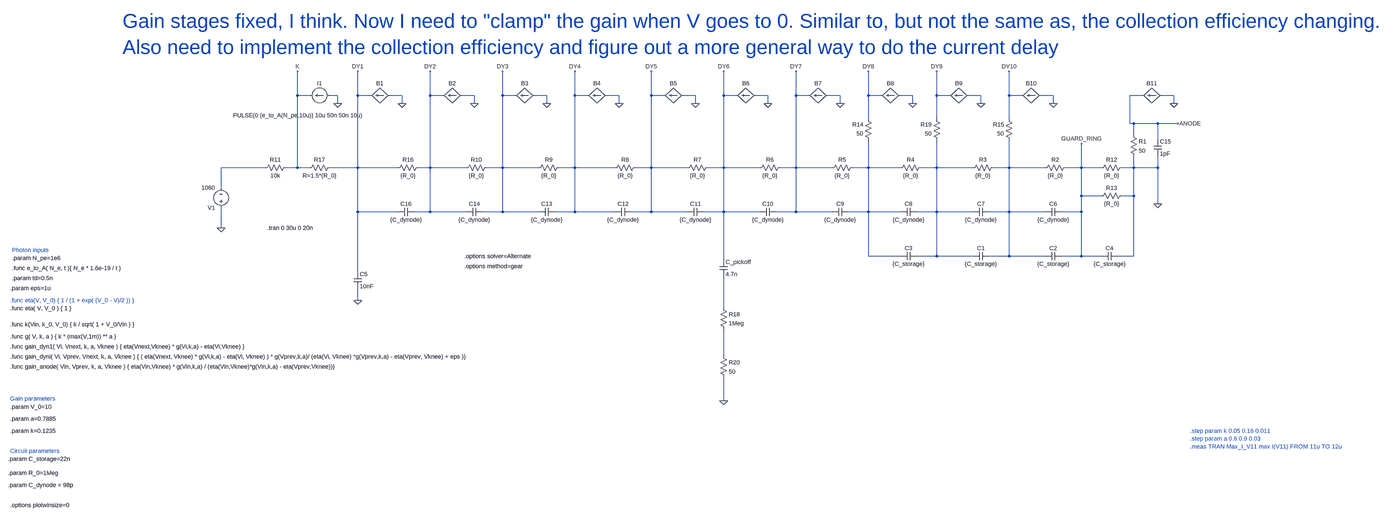
[diagram p0: schematic R12699 model - power law - S2 - no Vsources.asc, whole sheet]
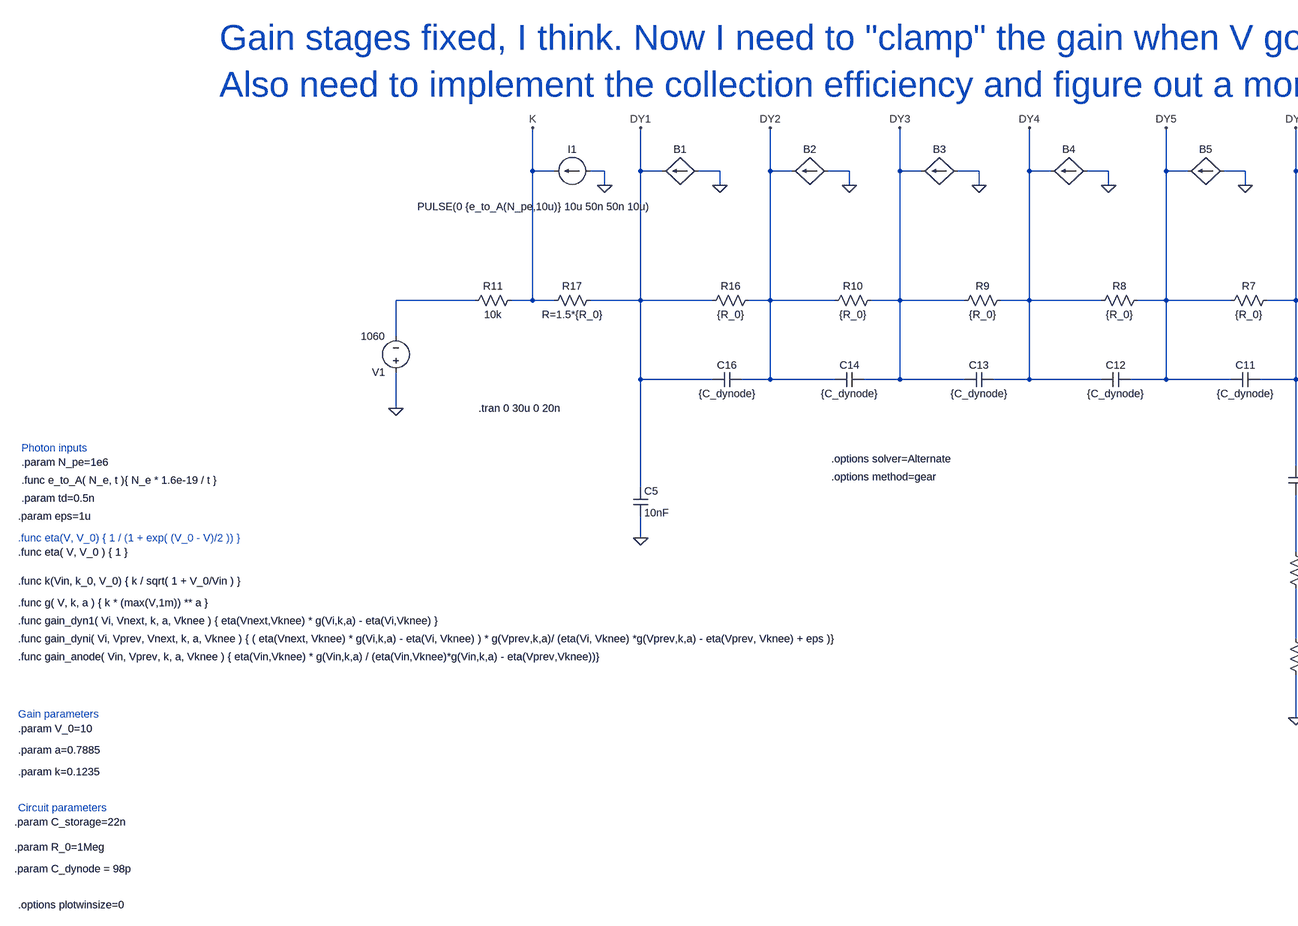
[diagram p1: schematic R12699 model - power law - S2 - no Vsources.asc, part, row 1 of 1, column 1 of 2]
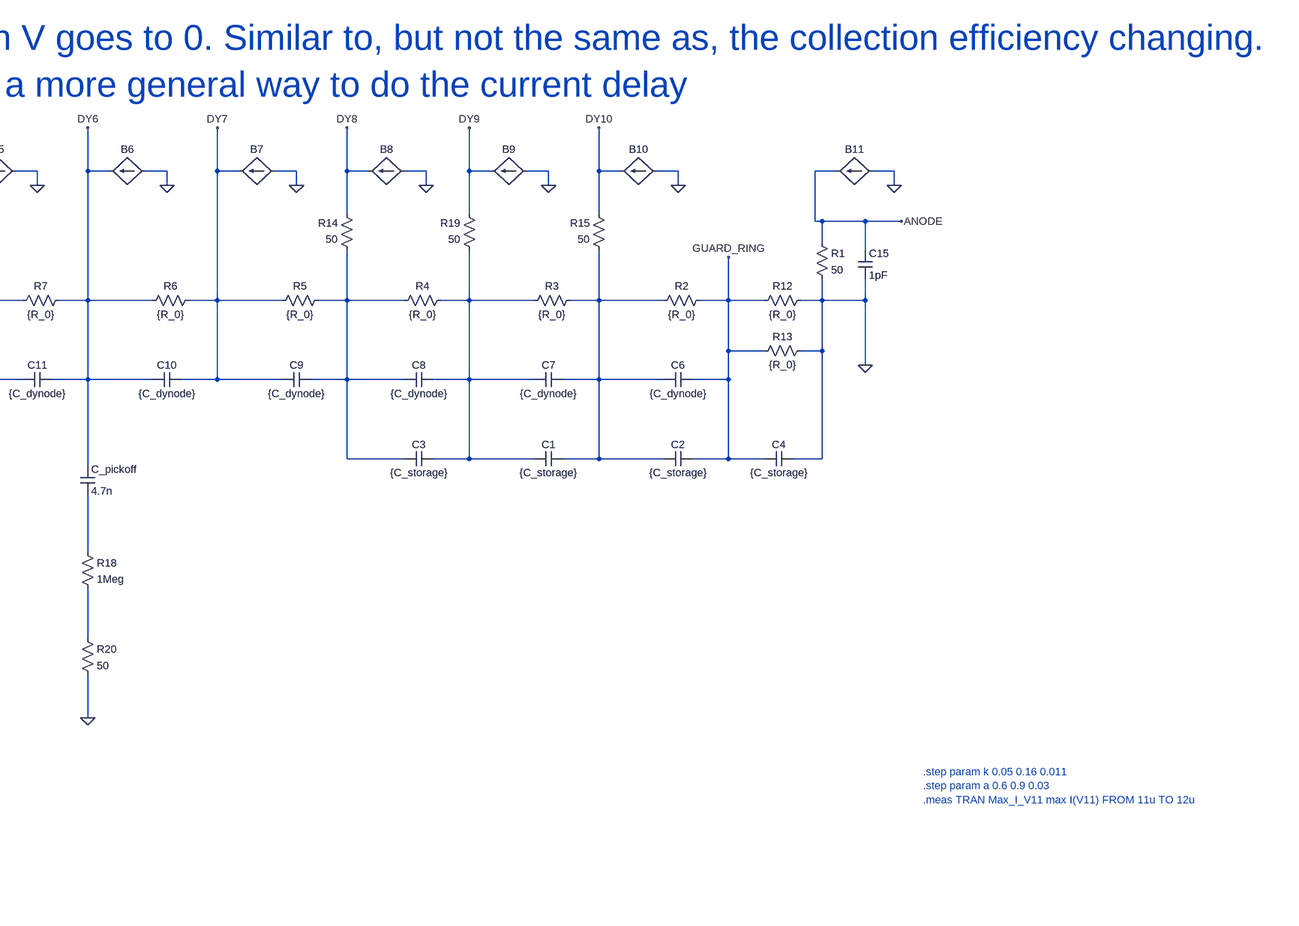
[diagram p2: schematic R12699 model - power law - S2 - no Vsources.asc, part, row 1 of 1, column 2 of 2]
R12699 model - power law - S2 - no Vsources.asc, the LTspice schematic file:
Version 4.1
SHEET 1 3076 1700
WIRE -2464 -544 -2464 -640
WIRE -2416 -544 -2464 -544
WIRE -2304 -544 -2336 -544
WIRE -2224 -544 -2224 -640
WIRE -2176 -544 -2224 -544
WIRE -2048 -544 -2096 -544
WIRE -1936 -544 -1936 -640
WIRE -1888 -544 -1936 -544
WIRE -1760 -544 -1808 -544
WIRE -1648 -544 -1648 -640
WIRE -1600 -544 -1648 -544
WIRE -1472 -544 -1520 -544
WIRE -1360 -544 -1360 -640
WIRE -1312 -544 -1360 -544
WIRE -1184 -544 -1232 -544
WIRE -1056 -544 -1056 -640
WIRE -1008 -544 -1056 -544
WIRE -880 -544 -928 -544
WIRE -768 -544 -768 -640
WIRE -720 -544 -768 -544
WIRE -592 -544 -640 -544
WIRE -480 -544 -480 -640
WIRE -432 -544 -480 -544
WIRE -304 -544 -352 -544
WIRE -192 -544 -192 -640
WIRE -144 -544 -192 -544
WIRE -16 -544 -64 -544
WIRE 80 -544 80 -640
WIRE 128 -544 80 -544
WIRE 256 -544 208 -544
WIRE 368 -544 368 -640
WIRE 416 -544 368 -544
WIRE 544 -544 496 -544
WIRE 896 -544 848 -544
WIRE 1024 -544 976 -544
WIRE -2304 -512 -2304 -544
WIRE -2048 -512 -2048 -544
WIRE -1760 -512 -1760 -544
WIRE -1472 -512 -1472 -544
WIRE -1184 -512 -1184 -544
WIRE -880 -512 -880 -544
WIRE -592 -512 -592 -544
WIRE -304 -512 -304 -544
WIRE -16 -512 -16 -544
WIRE 256 -512 256 -544
WIRE 544 -512 544 -544
WIRE 1024 -512 1024 -544
WIRE -192 -448 -192 -544
WIRE 80 -448 80 -544
WIRE 368 -448 368 -544
WIRE 848 -432 848 -544
WIRE 864 -432 848 -432
WIRE 960 -432 864 -432
WIRE 1040 -432 960 -432
WIRE 864 -384 864 -432
WIRE 960 -368 960 -432
WIRE -2592 -256 -2768 -256
WIRE -2464 -256 -2464 -544
WIRE -2464 -256 -2512 -256
WIRE -2416 -256 -2464 -256
WIRE -2224 -256 -2224 -544
WIRE -2224 -256 -2336 -256
WIRE -2064 -256 -2224 -256
WIRE -1936 -256 -1936 -544
WIRE -1936 -256 -1984 -256
WIRE -1792 -256 -1936 -256
WIRE -1648 -256 -1648 -544
WIRE -1648 -256 -1712 -256
WIRE -1504 -256 -1648 -256
WIRE -1360 -256 -1360 -544
WIRE -1360 -256 -1424 -256
WIRE -1200 -256 -1360 -256
WIRE -1056 -256 -1056 -544
WIRE -1056 -256 -1120 -256
WIRE -912 -256 -1056 -256
WIRE -768 -256 -768 -544
WIRE -768 -256 -832 -256
WIRE -624 -256 -768 -256
WIRE -480 -256 -480 -544
WIRE -480 -256 -544 -256
WIRE -336 -256 -480 -256
WIRE -192 -256 -192 -368
WIRE -192 -256 -256 -256
WIRE -64 -256 -192 -256
WIRE 80 -256 80 -368
WIRE 80 -256 16 -256
WIRE 224 -256 80 -256
WIRE 368 -256 368 -368
WIRE 368 -256 304 -256
WIRE 512 -256 368 -256
WIRE 656 -256 656 -352
WIRE 656 -256 592 -256
WIRE 736 -256 656 -256
WIRE 864 -256 864 -304
WIRE 864 -256 816 -256
WIRE 960 -256 960 -304
WIRE 960 -256 864 -256
WIRE -2768 -176 -2768 -256
WIRE 656 -144 656 -256
WIRE 736 -144 656 -144
WIRE 864 -144 864 -256
WIRE 864 -144 816 -144
WIRE 960 -112 960 -256
WIRE -2224 -80 -2224 -256
WIRE -2064 -80 -2224 -80
WIRE -1936 -80 -1936 -256
WIRE -1936 -80 -2000 -80
WIRE -1792 -80 -1936 -80
WIRE -1648 -80 -1648 -256
WIRE -1648 -80 -1728 -80
WIRE -1504 -80 -1648 -80
WIRE -1360 -80 -1360 -256
WIRE -1360 -80 -1440 -80
WIRE -1200 -80 -1360 -80
WIRE -1056 -80 -1056 -256
WIRE -1056 -80 -1136 -80
WIRE -912 -80 -1056 -80
WIRE -768 -80 -768 -256
WIRE -768 -80 -848 -80
WIRE -624 -80 -768 -80
WIRE -480 -80 -480 -256
WIRE -480 -80 -560 -80
WIRE -336 -80 -480 -80
WIRE -192 -80 -192 -256
WIRE -192 -80 -272 -80
WIRE -64 -80 -192 -80
WIRE 80 -80 80 -256
WIRE 80 -80 0 -80
WIRE 224 -80 80 -80
WIRE 368 -80 368 -256
WIRE 368 -80 288 -80
WIRE 512 -80 368 -80
WIRE 656 -80 656 -144
WIRE 656 -80 576 -80
WIRE -2768 -16 -2768 -96
WIRE -192 96 -192 -80
WIRE -64 96 -192 96
WIRE 80 96 80 -80
WIRE 80 96 0 96
WIRE 224 96 80 96
WIRE 368 96 368 -80
WIRE 368 96 288 96
WIRE 512 96 368 96
WIRE 656 96 656 -80
WIRE 656 96 576 96
WIRE 736 96 656 96
WIRE 864 96 864 -144
WIRE 864 96 800 96
WIRE -768 112 -768 -80
WIRE -2224 160 -2224 -80
WIRE -2224 272 -2224 224
WIRE -768 304 -768 176
WIRE -768 496 -768 384
WIRE -768 672 -768 576
FLAG -2224 272 0
FLAG 960 -112 0
FLAG -2768 -16 0
FLAG -2224 -640 DY1
FLAG -1936 -640 DY2
FLAG -1648 -640 DY3
FLAG -1360 -640 DY4
FLAG -1056 -640 DY5
FLAG -768 -640 DY6
FLAG -480 -640 DY7
FLAG -192 -640 DY8
FLAG 80 -640 DY9
FLAG 368 -640 DY10
FLAG 656 -352 GUARD_RING
FLAG -2464 -640 K
FLAG 1040 -432 ANODE
FLAG -768 672 0
FLAG -2304 -512 0
FLAG -2048 -512 0
FLAG -1760 -512 0
FLAG -1472 -512 0
FLAG -1184 -512 0
FLAG -880 -512 0
FLAG -592 -512 0
FLAG -304 -512 0
FLAG -16 -512 0
FLAG 256 -512 0
FLAG 544 -512 0
FLAG 1024 -512 0
SYMBOL cap 288 80 R90
WINDOW 0 0 32 VBottom 2
WINDOW 3 32 32 VTop 2
SYMATTR InstName C1
SYMATTR Value {C_storage}
SYMBOL cap 576 80 R90
WINDOW 0 0 32 VBottom 2
WINDOW 3 32 32 VTop 2
SYMATTR InstName C2
SYMATTR Value {C_storage}
SYMBOL cap 0 80 R90
WINDOW 0 0 32 VBottom 2
WINDOW 3 32 32 VTop 2
SYMATTR InstName C3
SYMATTR Value {C_storage}
SYMBOL cap 800 80 R90
WINDOW 0 0 32 VBottom 2
WINDOW 3 32 32 VTop 2
SYMATTR InstName C4
SYMATTR Value {C_storage}
SYMBOL cap -2240 160 R0
SYMATTR InstName C5
SYMATTR Value 10nF
SYMBOL cap 576 -96 R90
WINDOW 0 0 32 VBottom 2
WINDOW 3 32 32 VTop 2
SYMATTR InstName C6
SYMATTR Value {C_dynode}
SYMBOL res 608 -272 R90
WINDOW 0 0 56 VBottom 2
WINDOW 3 32 56 VTop 2
SYMATTR InstName R2
SYMATTR Value {R_0}
SYMBOL cap 288 -96 R90
WINDOW 0 0 32 VBottom 2
WINDOW 3 32 32 VTop 2
SYMATTR InstName C7
SYMATTR Value {C_dynode}
SYMBOL res 320 -272 R90
WINDOW 0 0 56 VBottom 2
WINDOW 3 32 56 VTop 2
SYMATTR InstName R3
SYMATTR Value {R_0}
SYMBOL cap 0 -96 R90
WINDOW 0 0 32 VBottom 2
WINDOW 3 32 32 VTop 2
SYMATTR InstName C8
SYMATTR Value {C_dynode}
SYMBOL res 32 -272 R90
WINDOW 0 0 56 VBottom 2
WINDOW 3 32 56 VTop 2
SYMATTR InstName R4
SYMATTR Value {R_0}
SYMBOL cap -272 -96 R90
WINDOW 0 0 32 VBottom 2
WINDOW 3 32 32 VTop 2
SYMATTR InstName C9
SYMATTR Value {C_dynode}
SYMBOL res -240 -272 R90
WINDOW 0 0 56 VBottom 2
WINDOW 3 32 56 VTop 2
SYMATTR InstName R5
SYMATTR Value {R_0}
SYMBOL cap -560 -96 R90
WINDOW 0 0 32 VBottom 2
WINDOW 3 32 32 VTop 2
SYMATTR InstName C10
SYMATTR Value {C_dynode}
SYMBOL res -528 -272 R90
WINDOW 0 0 56 VBottom 2
WINDOW 3 32 56 VTop 2
SYMATTR InstName R6
SYMATTR Value {R_0}
SYMBOL cap -848 -96 R90
WINDOW 0 0 32 VBottom 2
WINDOW 3 32 32 VTop 2
SYMATTR InstName C11
SYMATTR Value {C_dynode}
SYMBOL res -816 -272 R90
WINDOW 0 0 56 VBottom 2
WINDOW 3 32 56 VTop 2
SYMATTR InstName R7
SYMATTR Value {R_0}
SYMBOL cap -1136 -96 R90
WINDOW 0 0 32 VBottom 2
WINDOW 3 32 32 VTop 2
SYMATTR InstName C12
SYMATTR Value {C_dynode}
SYMBOL res -1104 -272 R90
WINDOW 0 0 56 VBottom 2
WINDOW 3 32 56 VTop 2
SYMATTR InstName R8
SYMATTR Value {R_0}
SYMBOL cap -1440 -96 R90
WINDOW 0 0 32 VBottom 2
WINDOW 3 32 32 VTop 2
SYMATTR InstName C13
SYMATTR Value {C_dynode}
SYMBOL res -1408 -272 R90
WINDOW 0 0 56 VBottom 2
WINDOW 3 32 56 VTop 2
SYMATTR InstName R9
SYMATTR Value {R_0}
SYMBOL cap -1728 -96 R90
WINDOW 0 0 32 VBottom 2
WINDOW 3 32 32 VTop 2
SYMATTR InstName C14
SYMATTR Value {C_dynode}
SYMBOL res -1696 -272 R90
WINDOW 0 0 56 VBottom 2
WINDOW 3 32 56 VTop 2
SYMATTR InstName R10
SYMATTR Value {R_0}
SYMBOL res -2496 -272 R90
WINDOW 0 0 56 VBottom 2
WINDOW 3 32 56 VTop 2
SYMATTR InstName R11
SYMATTR Value 10k
SYMBOL res 832 -272 R90
WINDOW 0 0 56 VBottom 2
WINDOW 3 32 56 VTop 2
SYMATTR InstName R12
SYMATTR Value {R_0}
SYMBOL res 832 -160 R90
WINDOW 0 0 56 VBottom 2
WINDOW 3 32 56 VTop 2
SYMATTR InstName R13
SYMATTR Value {R_0}
SYMBOL res 384 -352 R180
WINDOW 0 36 76 Left 2
WINDOW 3 36 40 Left 2
SYMATTR InstName R15
SYMATTR Value 50
SYMBOL cap -2000 -96 R90
WINDOW 0 0 32 VBottom 2
WINDOW 3 32 32 VTop 2
SYMATTR InstName C16
SYMATTR Value {C_dynode}
SYMBOL res -1968 -272 R90
WINDOW 0 0 56 VBottom 2
WINDOW 3 32 56 VTop 2
SYMATTR InstName R16
SYMATTR Value {R_0}
SYMBOL bi -2096 -544 R90
WINDOW 0 -32 40 VBottom 2
WINDOW 3 32 40 Invisible 2
SYMATTR InstName B1
SYMATTR Value I  = I(I1) * gain_dyn1( V(DY1,K), V( DY2, DY1), k, a, V_0 )
SYMBOL bi -1808 -544 R90
WINDOW 0 -32 40 VBottom 2
WINDOW 3 32 40 Invisible 2
SYMATTR InstName B2
SYMATTR Value I=delay(I(B1),td) * gain_dyni( V( DY2, DY1), V(DY1,K),  V( DY3, DY2), k, a, V_0 )
SYMBOL bi -1520 -544 R90
WINDOW 0 -32 40 VBottom 2
WINDOW 3 32 40 Invisible 2
SYMATTR InstName B3
SYMATTR Value I=delay(I(B2),td)* gain_dyni( V( DY3, DY2), V(DY2, DY1), V( DY4, DY3), k, a, V_0 )
SYMBOL current -2336 -544 R90
WINDOW 0 -32 40 VBottom 2
WINDOW 3 64 125 VTop 2
WINDOW 123 0 0 Left 0
WINDOW 39 0 0 Left 0
SYMATTR InstName I1
SYMATTR Value PULSE(0 {e_to_A(N_pe,10u)} 10u 50n 50n 10u)
SYMBOL bi -1232 -544 R90
WINDOW 0 -32 40 VBottom 2
WINDOW 3 32 40 Invisible 2
SYMATTR InstName B4
SYMATTR Value I=delay(I(B3),td)* gain_dyni( V( DY4, DY3), V(DY3,DY2), V( DY5, DY4), k, a, V_0 )
SYMBOL bi -928 -544 R90
WINDOW 0 -32 40 VBottom 2
WINDOW 3 32 40 Invisible 2
SYMATTR InstName B5
SYMATTR Value I=delay(I(B4),td) * gain_dyni( V( DY5, DY4), V(DY4,DY3), V( DY6, DY5), k, a, V_0 )
SYMBOL bi -640 -544 R90
WINDOW 0 -32 40 VBottom 2
WINDOW 3 32 40 Invisible 2
SYMATTR InstName B6
SYMATTR Value I=delay(I(B5),td) * gain_dyni( V( DY6, DY5), V(DY5,DY4), V( DY7, DY6), k, a, V_0 )
SYMBOL bi -352 -544 R90
WINDOW 0 -32 40 VBottom 2
WINDOW 3 32 40 Invisible 2
SYMATTR InstName B7
SYMATTR Value I=delay(I(B6),td) * gain_dyni( V( DY7, DY6), V(DY6,DY5), V( DY8, DY7), k, a, V_0 )
SYMBOL bi -64 -544 R90
WINDOW 0 -32 40 VBottom 2
WINDOW 3 32 40 Invisible 2
SYMATTR InstName B8
SYMATTR Value I=delay(I(B7),td)* gain_dyni( V( DY8, DY7), V(DY7,DY6), V( DY9, DY8), k, a, V_0 )
SYMBOL bi 208 -544 R90
WINDOW 0 -32 40 VBottom 2
WINDOW 3 32 40 Invisible 2
SYMATTR InstName B9
SYMATTR Value I=delay(I(B8),td) * gain_dyni( V( DY9, DY8), V(DY8,DY7), V(DY10,DY9), k, a, V_0 )
SYMBOL bi 496 -544 R90
WINDOW 0 -32 40 VBottom 2
WINDOW 3 32 40 Invisible 2
SYMATTR InstName B10
SYMATTR Value I=delay(I(B9),td) * gain_dyni( V(DY10,DY9), V(DY9,DY8), V(ANODE,DY10), k, a, V_0)
SYMBOL res -2320 -272 R90
WINDOW 0 0 56 VBottom 2
WINDOW 3 32 56 VTop 2
SYMATTR InstName R17
SYMATTR Value R=1.5*{R_0}
SYMBOL voltage -2768 -80 R180
WINDOW 123 0 0 Left 0
WINDOW 39 0 0 Left 0
SYMATTR InstName V1
SYMATTR Value 1060
SYMBOL cap -784 112 R0
SYMATTR InstName C_pickoff
SYMATTR Value 4.7n
SYMBOL res -784 288 R0
SYMATTR InstName R18
SYMATTR Value 1Meg
SYMBOL res 848 -400 R0
SYMATTR InstName R1
SYMATTR Value 50
SYMBOL res -176 -352 R180
WINDOW 0 36 76 Left 2
WINDOW 3 36 40 Left 2
SYMATTR InstName R14
SYMATTR Value 50
SYMBOL res 96 -352 R180
WINDOW 0 36 76 Left 2
WINDOW 3 36 40 Left 2
SYMATTR InstName R19
SYMATTR Value 50
SYMBOL res -784 480 R0
SYMATTR InstName R20
SYMATTR Value 50
SYMBOL cap 944 -368 R0
SYMATTR InstName C15
SYMATTR Value 1pF
SYMBOL bi 976 -544 R90
WINDOW 0 -32 40 VBottom 2
WINDOW 3 32 40 Invisible 2
SYMATTR InstName B11
SYMATTR Value I = -delay(I(B10),td) / ( 1 - 1/( eta(V(ANODE,DY10),V_0)*g(V(DY10,DY9),k,a) ) + eps )
TEXT -2584 -16 Left 2 !.tran 0 30u 0 20n
TEXT -3608 496 Left 2 !.func gain_dyni( Vi, Vprev, Vnext, k, a, Vknee ) { ( eta(Vnext, Vknee) * g(Vi,k,a) - eta(Vi, Vknee) ) * g(Vprev,k,a)/ (eta(Vi, Vknee) *g(Vprev,k,a) - eta(Vprev, Vknee) + eps )}
TEXT -3608 696 Left 2 !.param V_0=10
TEXT -3608 744 Left 2 !.param a=0.7885
TEXT -3608 792 Left 2 !.param k=0.1235
TEXT -3616 904 Left 2 !.param C_storage=22n
TEXT -3616 960 Left 2 !.param R_0=1Meg
TEXT -3616 1008 Left 2 !.param C_dynode = 98p
TEXT -3600 144 Left 2 !.func e_to_A( N_e, t ){ N_e * 1.6e-19 / t }
TEXT -3600 104 Left 2 !.param N_pe=1e6
TEXT 1088 792 Left 2 ;.step param k 0.05 0.16 0.011\n.step param a 0.6 0.9 0.03\n.meas TRAN Max_I_V11 max I(V11) FROM 11u TO 12u
TEXT -3608 1088 Left 2 !.options plotwinsize=0
TEXT -1800 96 Left 2 !.options solver=Alternate
TEXT -3608 536 Left 2 !.func gain_anode( Vin, Vprev, k, a, Vknee ) { eta(Vin,Vknee) * g(Vin,k,a) / (eta(Vin,Vknee)*g(Vin,k,a) - eta(Vprev,Vknee))}
TEXT -3608 272 Left 2 ;.func eta(V, V_0) { 1 / (1 + exp( (V_0 - V)/2 )) }
TEXT -3608 304 Left 2 !.func eta( V, V_0 ) { 1 }
TEXT -3608 664 Left 2 ;Gain parameters
TEXT -3608 872 Left 2 ;Circuit parameters
TEXT -3600 72 Left 2 ;Photon inputs
TEXT -3608 416 Left 2 !.func g( V, k, a ) { k * (max(V,1m)) ** a }
TEXT -3608 224 Left 2 !.param eps=1u
TEXT -3160 -840 Left 6 ;Gain stages fixed, I think. Now I need to "clamp" the gain when V goes to 0. Similar to, but not the same as, the collection efficiency changing.\nAlso need to implement the collection efficiency and figure out a more general way to do the current delay
TEXT -3608 456 Left 2 !.func gain_dyn1( Vi, Vnext, k, a, Vknee ) { eta(Vnext,Vknee) * g(Vi,k,a) - eta(Vi,Vknee) }
TEXT -3600 184 Left 2 !.param td=0.5n
TEXT -1800 136 Left 2 !.options method=gear
TEXT -3608 368 Left 2 !.func k(Vin, k_0, V_0) { k / sqrt( 1 + V_0/Vin ) }

The netlist it stands for:
* R12699 model - power law - S2 - no Vsources.asc
C1 N004 N003 {C_storage}
C2 GUARD_RING N004 {C_storage}
C3 N003 N002 {C_storage}
C4 0 GUARD_RING {C_storage}
C5 DY1 0 10nF
C6 GUARD_RING N004 {C_dynode}
R2 GUARD_RING N004 {R_0}
C7 N004 N003 {C_dynode}
R3 N004 N003 {R_0}
C8 N003 N002 {C_dynode}
R4 N003 N002 {R_0}
C9 N002 DY7 {C_dynode}
R5 N002 DY7 {R_0}
C10 DY7 DY6 {C_dynode}
R6 DY7 DY6 {R_0}
C11 DY6 DY5 {C_dynode}
R7 DY6 DY5 {R_0}
C12 DY5 DY4 {C_dynode}
R8 DY5 DY4 {R_0}
C13 DY4 DY3 {C_dynode}
R9 DY4 DY3 {R_0}
C14 DY3 DY2 {C_dynode}
R10 DY3 DY2 {R_0}
R11 K N001 10k
R12 0 GUARD_RING {R_0}
R13 0 GUARD_RING {R_0}
R15 N004 DY10 50
C16 DY2 DY1 {C_dynode}
R16 DY2 DY1 {R_0}
B1 0 DY1 I  = I(I1) * gain_dyn1( V(DY1,K), V( DY2, DY1), k, a, V_0 )
B2 0 DY2 I=delay(I(B1),td) * gain_dyni( V( DY2, DY1), V(DY1,K),  V( DY3, DY2), k, a, V_0 )
B3 0 DY3 I=delay(I(B2),td)* gain_dyni( V( DY3, DY2), V(DY2, DY1), V( DY4, DY3), k, a, V_0 )
I1 0 K PULSE(0 {e_to_A(N_pe,10u)} 10u 50n 50n 10u)
B4 0 DY4 I=delay(I(B3),td)* gain_dyni( V( DY4, DY3), V(DY3,DY2), V( DY5, DY4), k, a, V_0 )
B5 0 DY5 I=delay(I(B4),td) * gain_dyni( V( DY5, DY4), V(DY4,DY3), V( DY6, DY5), k, a, V_0 )
B6 0 DY6 I=delay(I(B5),td) * gain_dyni( V( DY6, DY5), V(DY5,DY4), V( DY7, DY6), k, a, V_0 )
B7 0 DY7 I=delay(I(B6),td) * gain_dyni( V( DY7, DY6), V(DY6,DY5), V( DY8, DY7), k, a, V_0 )
B8 0 DY8 I=delay(I(B7),td)* gain_dyni( V( DY8, DY7), V(DY7,DY6), V( DY9, DY8), k, a, V_0 )
B9 0 DY9 I=delay(I(B8),td) * gain_dyni( V( DY9, DY8), V(DY8,DY7), V(DY10,DY9), k, a, V_0 )
B10 0 DY10 I=delay(I(B9),td) * gain_dyni( V(DY10,DY9), V(DY9,DY8), V(ANODE,DY10), k, a, V_0)
R17 DY1 K R=1.5*{R_0}
V1 0 N001 1060
C_pickoff DY6 N005 4.7n
R18 N005 N006 1Meg
R1 ANODE 0 50
R14 N002 DY8 50
R19 N003 DY9 50
R20 N006 0 50
C15 ANODE 0 1pF
B11 0 ANODE I = -delay(I(B10),td) / ( 1 - 1/( eta(V(ANODE,DY10),V_0)*g(V(DY10,DY9),k,a) ) + eps )
.tran 0 30u 0 20n
.func gain_dyni( Vi, Vprev, Vnext, k, a, Vknee ) { ( eta(Vnext, Vknee) * g(Vi,k,a) - eta(Vi, Vknee) ) * g(Vprev,k,a)/ (eta(Vi, Vknee) *g(Vprev,k,a) - eta(Vprev, Vknee) + eps )}
.param V_0=10
.param a=0.7885
.param k=0.1235
.param C_storage=22n
.param R_0=1Meg
.param C_dynode = 98p
.func e_to_A( N_e, t ){ N_e * 1.6e-19 / t }
.param N_pe=1e6
* .step param k 0.05 0.16 0.011
* .step param a 0.6 0.9 0.03
* .meas TRAN Max_I_V11 max I(V11) FROM 11u TO 12u
.options plotwinsize=0
.options solver=Alternate
.func gain_anode( Vin, Vprev, k, a, Vknee ) { eta(Vin,Vknee) * g(Vin,k,a) / (eta(Vin,Vknee)*g(Vin,k,a) - eta(Vprev,Vknee))}
* .func eta(V, V_0) { 1 / (1 + exp( (V_0 - V)/2 )) }
.func eta( V, V_0 ) { 1 }
* Gain parameters
* Circuit parameters
* Photon inputs
.func g( V, k, a ) { k * (max(V,1m)) ** a }
.param eps=1u
* Gain stages fixed, I think. Now I need to "clamp" the gain when V goes to 0. Similar to, but not the same as, the collection efficiency changing.
* Also need to implement the collection efficiency and figure out a more general way to do the current delay
.func gain_dyn1( Vi, Vnext, k, a, Vknee ) { eta(Vnext,Vknee) * g(Vi,k,a) - eta(Vi,Vknee) }
.param td=0.5n
.options method=gear
.func k(Vin, k_0, V_0) { k / sqrt( 1 + V_0/Vin ) }
.backanno
.end